# Altium schematic sheet I2C bus components.SchDoc
size B; SheetNumber: 3; SheetTotal: 3
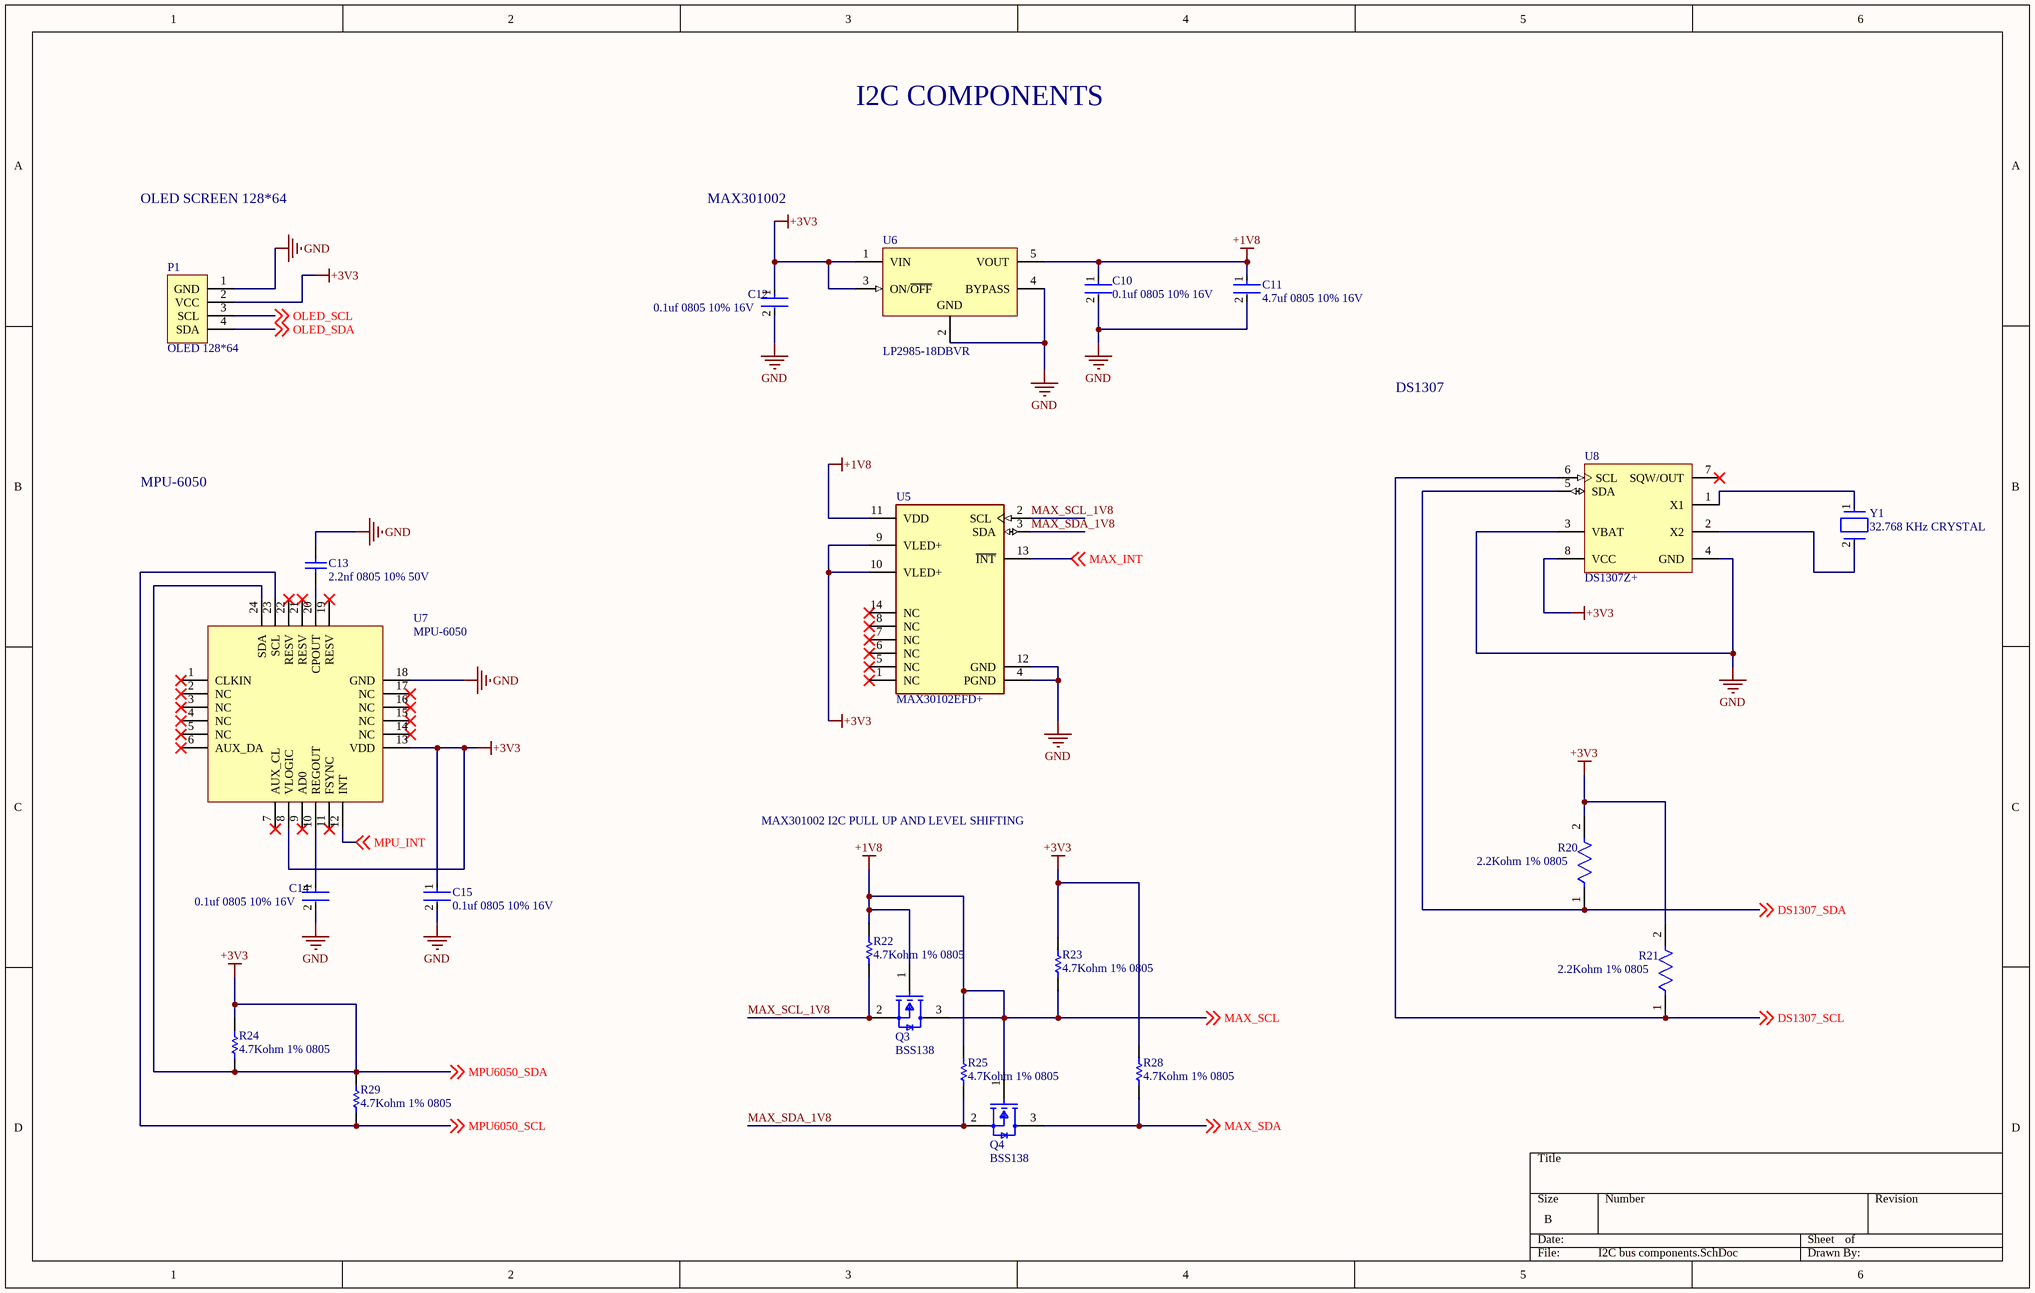
[diagram p0: I2C bus components.SchDoc]

## Parts
C10  0.1uf 0805 10% 16V  [FP-CC0805-0_85-MFG]
C11  4.7uf 0805 10% 16V  [FP-CGA4J-IPC_A]
C12  0.1uf 0805 10% 16V  [FP-CC0805-0_85-MFG]
C13  2.2nf 0805 10% 50V  [CAPC2013X135X50NL15T20]
C14  0.1uf 0805 10% 16V  [FP-CC0805-0_85-MFG]
C15  0.1uf 0805 10% 16V  [FP-CC0805-0_85-MFG]
P1  OLED 128*64  [4pins smd]
Q3  BSS138  [FP-318-08-IPC_B]
Q4  BSS138  [FP-318-08-IPC_B]
R20  2.2Kohm 1% 0805  [FP-RT0805-MFG]
R21  2.2Kohm 1% 0805  [FP-RT0805-MFG]
R22  4.7Kohm 1% 0805  [RESC0805(2012)_M]
R23  4.7Kohm 1% 0805  [RESC0805(2012)_M]
R24  4.7Kohm 1% 0805  [RESC0805(2012)_M]
R25  4.7Kohm 1% 0805  [RESC0805(2012)_M]
R28  4.7Kohm 1% 0805  [RESC0805(2012)_M]
R29  4.7Kohm 1% 0805  [RESC0805(2012)_M]
U5  MAX30102EFD+  [MAX30102]
U6  LP2985-18DBVR  [DBV0005A_M]
U7  MPU-6050  [MPU-6050]
U8  DS1307Z+  [S8+2_L]
Y1  32.768 KHz CRYSTAL  [FP-ECX-34Q-MFG]

## Nets
+1V8: C10.1 C11.1 Q3.1(G) Q3.3(D) Q4.1(G) R22.2 R23.1 R25.2 U5.11(VDD) U6.5(VOUT) ; off-sheet MAX_SCL  [also labelled MAX_SCL]
+3V3: C12.1 C15.1 P1.2(VCC) R20.2 R21.2 R23.2 R24.1 R24.2 R28.2 R29.2 U5.9(VLED+) U5.10(VLED+) U6.1(VIN) U6.3(ON/~{OFF}) U7.8(VLOGIC) U7.13(VDD) U7.24(SDA) U8.8(VCC) ; off-sheet MPU6050_SDA  [also labelled MPU6050_SDA]
GND: C10.2 C11.2 C12.2 C13.2 C14.2 C15.2 P1.1(GND) U5.4(PGND) U5.12(GND) U6.2(GND) U6.4(BYPASS) U7.18(GND) U8.3(VBAT) U8.4(GND)
DS1307_SCL: R21.1 U8.6(SCL) ; off-sheet DS1307_SCL
DS1307_SDA: R20.1 U8.5(SDA) ; off-sheet DS1307_SDA
MAX_INT: U5.13(~{INT}) ; off-sheet MAX_INT
MAX_SCL_1V8: Q3.2(S) R22.1 U5.2(SCL)
MAX_SDA: Q4.3(D) R28.1 ; off-sheet MAX_SDA
MAX_SDA_1V8: Q4.2(S) R25.1 U5.3(SDA)
MPU6050_SCL: R29.1 U7.23(SCL) ; off-sheet MPU6050_SCL
MPU_INT: U7.12(INT) ; off-sheet MPU_INT
OLED_SCL: P1.3(SCL) ; off-sheet OLED_SCL
OLED_SDA: P1.4(SDA) ; off-sheet OLED_SDA
NetC13_1: C13.1 U7.20(CPOUT)
NetC14_1: C14.1 U7.10(REGOUT)
NetU8_1: U8.1(X1) Y1.1(In/Out)
NetU8_2: U8.2(X2) Y1.2(Out/In)

Not connected (* = marked no-connect by the designer): U5 1(NC)* 5(NC)* 6(NC)* 7(NC)* 8(NC)* 14(NC)*; U7 1(CLKIN)* 2(NC)* 3(NC)* 4(NC)* 5(NC)* 6(AUX_DA)* 7(AUX_CL)* 9(AD0)* 11(FSYNC)* 14(NC)* 15(NC)* 16(NC)* 17(NC)* 19(RESV)* 21(RESV)* 22(RESV)*; U8 7(SQW/OUT)*

## Notes on the sheet
- I2C COMPONENTS
- OLED SCREEN 128*64
- MAX301002
- DS1307
- MPU-6050
- MAX301002 I2C PULL UP AND LEVEL SHIFTING

## Library data of the parts
C10 C12 C14 C15 = CMP-1036-04402-6: CAP CER 0.1UF 16V X7R 0805; Manufacturer Part Number: CC0805KRX7R7BB104; Manufacturer: Yageo; Material: Ceramic; Tolerance: 0.1; Capacitance: 100 nF; Value: 100 nF; Temperature: -30°C to +85°C; Lead Free: Yes; Footprint Url: http://www.yageo.com/exep/pages/download/literatures/UPY-C_GEN_24.pdf; Voltage Rating: 16 V; Package: CC0805-0.85; RoHS: TRUE; Digikey Description: CAP CER 0.1UF 16V X7R 0805; Category: Cap; Octopart: https://octopart.com/cc0805krx7r7bb104-yageo-39467769; Device Class L3: Ceramic Capacitors; ComponentLink2URL: http://www.yageo.com/documents/recent/UPY-GPHC_Y5V_6.3V-to-50V_8.pdf; Temperature Range Low: -30°C; Mouser Description: Multilayer Ceramic Capacitors MLCC - SMD/SMT 100nF 16V X7R 10%; Automotive: No; Device Class L2: Capacitors; Height: 0.95mm; ComponentLink2Description: Datasheet; Temperature Characteristic: X7R; Ipc Land Pattern Name: CAPC200125X85; Device Class L1: Passive Components; Temperature Range High: +85°C
C11 = CMP-08246-002090-1: Cap Ceramic 4.7uF 16V X7R 10% Pad SMD 0805 +125°C Automotive T/R; Lead Free: Lead Free; Weight: 0.000194oz; Composition: Ceramic; Tolerance: 10%; Case/Package: 0805; Min Operating Temperature: -55°C; Case Code (Metric): 2012; Mount: Surface Mount; Thickness: 0.057inch; REACH SVHC: No SVHC; Package Quantity: 1; Termination: SMD/SMT; Max Operating Temperature: 125°C; Length: 2mm; Height: 1.25mm; Width: 0.049inch; Depth: 1.25mm; Dielectric: X7R; Ratings: AEC-Q200; Case Code (Imperial): 0805; Packaging: Tape and Reel; Capacitance: 4.7uF; Radiation Hardening: No; Voltage Rating (DC): 16V; Voltage Rating: 16V
C13 = CMP-2007-03445-1: Manufacturer: Vitramon; Part Number: VJ0805Y222KXACW1BC
Q3 Q4 = CMP-07173-000101-1: MOSFET N-CH 50V 220MA SOT-23; Turn-Off Delay Time: 20ns; Element Configuration: Single; Rds On Max: 3.5R; Gate to Source Voltage (Vgs): 20V; Threshold Voltage: 1.3V; Number of Elements: 1; Power Dissipation: 360mW; Rise Time: 9ns; Turn-On Delay Time: 2.5ns; Input Capacitance: 27pF; On-State Resistance: 6R; Lead Free: Lead Free; Length: 2.92mm; Width: 1.3mm; Drain to Source Breakdown Voltage: 50V; Min Operating Temperature: -55°C; REACH SVHC: No SVHC; Packaging: Tape and Reel; Radiation Hardening: No; Height: 0.93mm; Drain to Source Voltage (Vdss): 50V; Current Rating: 220mA; Voltage Rating (DC): 50V; Weight: 0.03g; Continuous Drain Current (ID): 220mA; Number of Pins: 3; Nominal Vgs: 1.3V; Max Power Dissipation: 360mW; Fall Time: 9ns; Drain to Source Resistance: 3.5R; Contact Plating: Tin; Case/Package: SOT-23; Package Quantity: 1; Dual Supply Voltage: 50V; Mount: Surface Mount; Termination: SMD/SMT; Max Operating Temperature: 150°C
R20 R21 = CMP-03412-009326-1: RES SMD 2.2K OHM 1% 1/8W 0805; Manufacturer Part Number: RT0805FRE072K2L; Manufacturer: Yageo; Tolerance: 0.0001; Power Rating: 0.125W; Voltage Rating: 150V; Temperature Coefficient: 50 ppm/°C; Value: 2.2KΩ; Footprint Url: http://www.yageo.com/exep/pages/download/literatures/PYu-R_Mount_10.pdf; Device Class L3: Chip SMD Resistors; Device Class L2: Resistors; ComponentLink2URL: http://www.yageo.com/documents/recent/PYu-RT_1-to-0.01_RoHS_L_9.pdf; Category: Res; Series: RT; Octopart: https://octopart.com/rt0805fre072k2l-yageo-42273028; Ipc Land Pattern Name: RESC200125X50; ComponentLink2Description: Datasheet; Lead Free: Yes; Temperature Range Low: -55°C; Composition: Thin Film; Temperature: -55°C to +155°C; Digikey Description: RES SMD 2.2K OHM 1% 1/8W 0805; Device Class L1: Passive Components; Temperature Range High: +155°C; Package: RT0805; Automotive: No; Height: 0.6mm; Mouser Description: High Precision-High Stability Chip Resistor Thin Film 0805 2.2kOhm 1% Paper T/R; RoHS: TRUE; Resistance: 2.2KΩ
R22-R25 R28 R29 = CMP-1013-00586-1: 4K7 0.125W 1% 0805 (2012 Metric)  SMD; Case-Metric: 2012; Case-EIA: 0805; Value: 4700.00 Ohm; Technology: SMT; Power: 0.125 W; Tolerance: 1 %
U5 = MAX30102EFD+: IC SENSOR OXIMETER/HEARTRATE; Manufacturer: Maxim; Min Supply Voltage: 1.7V; Max Supply Voltage: 2V; Supplier 1: Digi-Key; Manufacturer Part Number: MAX30102EFD+; RoHS: Yes; Category: Decoders and Multiplexers; Stock 1: 209; Pricing 1: 1=9.76000, 10=8.81500, 25=8.40480, 100=7.29800 (USD); Number of Pins: 14; Min Operating Temperature: -40°C; Max Operating Temperature: 85°C; REACH SVHC: No SVHC; ComponentLink1URL: http://www.farnell.com/datasheets/2162814.pdf?src-supplier=Farnell; ComponentLink1Description: http://www.farnell.com/datasheets/2162814.pdf?src-supplier=Farnell; ComponentLink2URL: http://www.farnell.com/datasheets/2162814.pdf?src-supplier=Element14; ComponentLink2Description: http://www.farnell.com/datasheets/2162814.pdf?src-supplier=Element14; ComponentLink3URL: https://datasheets.maximintegrated.com/en/ds/MAX30102.pdf?src-supplier=Digi-Key; ComponentLink3Description: https://datasheets.maximintegrated.com/en/ds/MAX30102.pdf?src-supplier=Digi-Key
U6 = CMP-0758-00065-2: Single Output Low Noise LDO, 150 mA, Fixed 1.8 V Output, 1.5% Tolerance, 2.2 to 16 V Input, Low IQ, 5-Pin SOT-23 (DBV), -40 to 125 degC, Green (RoHS & no Sb/Br), Tape and Reel; Manufacturer: Texas Instruments; Vdo (Typ) (mV): 280; Iout (Max) (A): 0.15; Output Options: Fixed Output; Iq (Typ) (mA): 0.85; Accuracy (%): 1.5; Fixed Output Options (V): 1.8; PackageReference: DBV0005A; DatasheetVersion: SLVS522N; RoHS: TRUE; ComponentLink1URL: http://www.ti.com/; ComponentLink3URL: http://www.ti.com/litv/pdf/mpds018j; ComponentLink3Description: Package Specification; Operating Temperature Range (degC): -40 to 125; Vin (V): 2.2 to 16; ComponentLink2URL: http://www.ti.com/lit/ds/symlink/lp2985-50.pdf; PartNumber: LP2985-18DBVR; Packing: Tape and Reel; Mounting Technology: Surface Mount; PackageDescription: 5-Pin Plastic Small Outline, Body 2.9 x 1.6 mm, Pitch 0.95 mm; ComponentLink2Description: Datasheet; PackageVersion: 4073253-4/L; ComponentLink1Description: Manufacturer URL
U7 = MPU-6050: INVENSENSE   MPU-6050   GYRO / ACCEL, 6-AXIS, I2C, QFN-24; Manufacturer: TDK InvenSense; Sensor Type: Accelerometer,Gyroscope,3 Axis; Supplier 1: Digi-Key; Manufacturer Part Number: MPU-6050; RoHS: Yes; Category: Inertial Measurement Units (IMUs); Stock 1: 4311; Pricing 1: 1=7.55000, 5=6.62600, 10=5.96300, 25=5.30000, 50=4.90260, 100=4.24000, 500=3.97500, 1000=3.71000 (USD); Mount: Surface Mount; Case/Package: QFN; Min Operating Temperature: -40°C; Max Operating Temperature: 85°C; Packaging: Tape and Reel; Output Type: I2C; ComponentLink1URL: https://datasheet.ciiva.com/1513/1788002-1513632.pdf?src-supplier=Element14; ComponentLink1Description: https://datasheet.ciiva.com/1513/1788002-1513632.pdf?src-supplier=Element14; ComponentLink2URL: https://datasheet.ciiva.com/22731/1788002-22731434.pdf?src-supplier=Element14; ComponentLink2Description: https://datasheet.ciiva.com/22731/1788002-22731434.pdf?src-supplier=Element14; Supplier Part Number 1: 1428-1007-1-ND
U8 = CMP-0254-00308-1: 64 x 8, Serial, I2C Real-Time Clock, 5.0V, 8-Pin SO, 0 to 70 degC, Pb-Free; ComponentLink3Description: Package Specification; DatasheetVersion: 10-Feb-2008; Code_IPC: SOIC127P600-8; ComponentLink2Description: Datasheet; Code_JEDEC: MS-012-AA; ComponentLink2URL: http://datasheets.maxim-ic.com/en/ds/DS1307.pdf; ComponentLink3URL: http://pdfserv.maxim-ic.com/package_dwgs/21-0041.PDF; ComponentLink1URL: http://www.maxim-ic.com; PackageReference: S8+2; ComponentLink1Description: Manufacturer URL; PackageDescription: 8-Pin Small-Outline IC, Narrow (0.15in), 1.27 mm Pitch, SOIC (N), Pb-Free; PackageVersion: revC, 2010
Y1 = CMP-40224-000019-1: CRYSTAL 32.768KHZ 12.5PF SMD; ESR (Equivalent Series Resistance): 80kR; Frequency Tolerance: 10ppm; Case/Package: SMD/SMT; Ratings: AEC-Q200; Width: 0.061inch; Length: 0.126inch; Min Operating Temperature: -40°C; Load Capacitance: 12.5pF; Max Operating Temperature: 125°C; Packaging: Tape and Reel; Height: 0.035inch; Mount: Surface Mount; Frequency: 32.768kHz